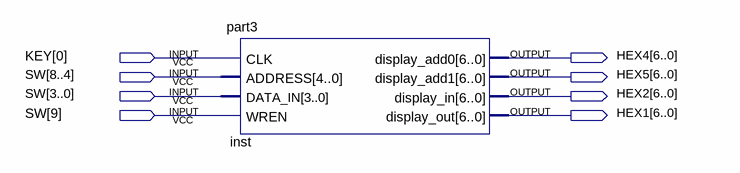
[diagram p0: schematic sheet]
// Quartus schematic part3_sch.bdf as structural Verilog: 1 symbols, 8 pins
module part3_sch (
  input  [0:0] KEY,
  input  [9:0] SW,
  output [6:0] HEX4,
  output [6:0] HEX5,
  output [6:0] HEX2,
  output [6:0] HEX1
);

  part3 inst (
    .CLK(KEY[0]), .ADDRESS(SW[8:4]), .DATA_IN(SW[3:0]), .WREN(SW[9]), .display_add0(HEX4),
    .display_add1(HEX5), .display_in(HEX2), .display_out(HEX1));
endmodule
